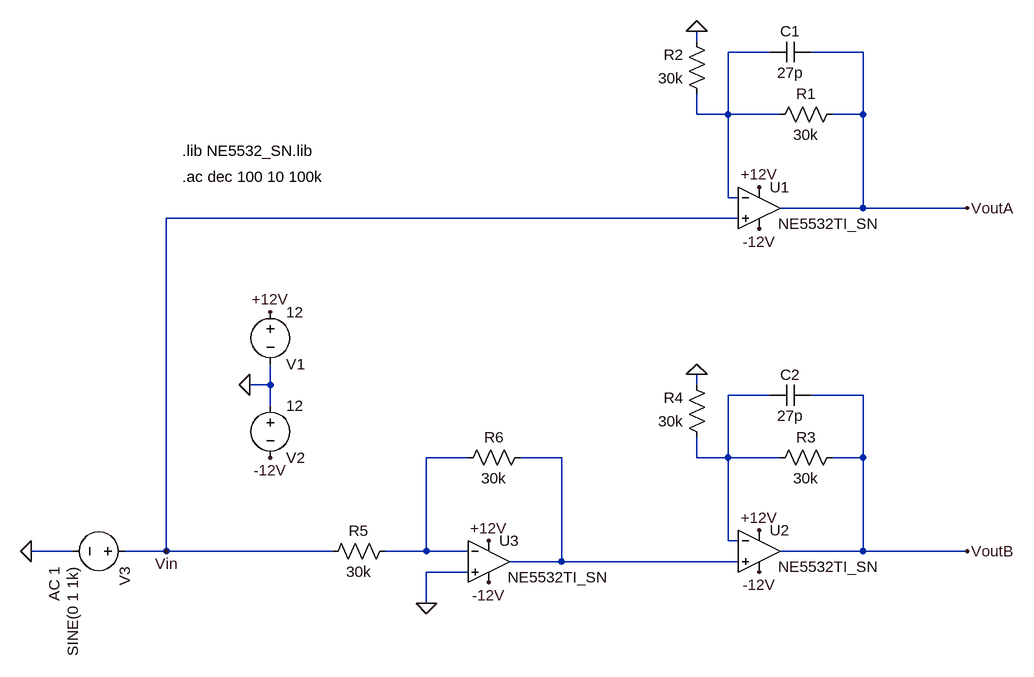
[diagram p0: schematic audio_amplifier.asc]
audio_amplifier.asc, the LTspice schematic file:
Version 4
SHEET 1 1172 960
WIRE 560 -80 560 -96
WIRE 672 -64 608 -64
WIRE 816 -64 736 -64
WIRE 560 32 560 0
WIRE 608 32 608 -64
WIRE 608 32 560 32
WIRE 688 32 608 32
WIRE 816 32 816 -64
WIRE 816 32 768 32
WIRE 608 160 608 32
WIRE 624 160 608 160
WIRE 816 176 816 32
WIRE 816 176 688 176
WIRE 976 176 816 176
WIRE 624 192 -256 192
WIRE -96 448 -96 416
WIRE -96 448 -128 448
WIRE 560 448 560 432
WIRE 672 464 608 464
WIRE 816 464 736 464
WIRE -96 480 -96 448
WIRE 208 560 144 560
WIRE 352 560 288 560
WIRE 560 560 560 528
WIRE 608 560 608 464
WIRE 608 560 560 560
WIRE 688 560 608 560
WIRE 816 560 816 464
WIRE 816 560 768 560
WIRE 608 688 608 560
WIRE 624 688 608 688
WIRE -400 704 -464 704
WIRE -256 704 -256 192
WIRE -256 704 -320 704
WIRE 0 704 -256 704
WIRE 144 704 144 560
WIRE 144 704 80 704
WIRE 208 704 144 704
WIRE 816 704 816 560
WIRE 816 704 688 704
WIRE 976 704 816 704
WIRE 352 720 352 560
WIRE 352 720 272 720
WIRE 624 720 352 720
WIRE 208 736 144 736
WIRE 144 784 144 736
FLAG -464 704 0
FLAG -96 560 -12V
FLAG -96 336 +12V
FLAG 656 144 +12V
FLAG 656 208 -12V
FLAG 976 176 VoutA
FLAG 560 -96 0
FLAG -256 704 Vin
FLAG -128 448 0
FLAG 656 672 +12V
FLAG 656 736 -12V
FLAG 976 704 VoutB
FLAG 560 432 0
FLAG 144 784 0
FLAG 240 752 -12V
FLAG 240 688 +12V
SYMBOL voltage -96 320 R0
WINDOW 0 24 96 Left 2
WINDOW 3 24 16 Left 2
WINDOW 123 0 0 Left 0
WINDOW 39 0 0 Left 0
SYMATTR InstName V1
SYMATTR Value 12
SYMBOL voltage -96 464 R0
WINDOW 0 24 96 Left 2
WINDOW 3 24 16 Left 2
WINDOW 123 0 0 Left 0
WINDOW 39 0 0 Left 0
SYMATTR InstName V2
SYMATTR Value 12
SYMBOL voltage -304 704 R90
WINDOW 123 24 124 Left 2
WINDOW 39 0 0 Left 0
SYMATTR Value2 AC 1
SYMATTR InstName V3
SYMATTR Value SINE(0 1 1k)
SYMBOL OpAmps\\opamp2 656 112 R0
WINDOW 3 29 88 Left 2
SYMATTR Value NE5532TI_SN
SYMATTR InstName U1
SYMATTR SpiceModel NE5532TI_SN
SYMBOL res 784 16 R90
WINDOW 0 0 56 VBottom 2
WINDOW 3 32 56 VTop 2
SYMATTR InstName R1
SYMATTR Value 30k
SYMBOL cap 736 -80 R90
WINDOW 0 0 32 VBottom 2
WINDOW 3 32 32 VTop 2
SYMATTR InstName C1
SYMATTR Value 27p
SYMBOL res 576 16 R180
WINDOW 0 36 76 Left 2
WINDOW 3 36 40 Left 2
SYMATTR InstName R2
SYMATTR Value 30k
SYMBOL OpAmps\\opamp2 656 640 R0
WINDOW 3 29 88 Left 2
SYMATTR Value NE5532TI_SN
SYMATTR InstName U2
SYMATTR SpiceModel NE5532TI_SN
SYMBOL res 784 544 R90
WINDOW 0 0 56 VBottom 2
WINDOW 3 32 56 VTop 2
SYMATTR InstName R3
SYMATTR Value 30k
SYMBOL cap 736 448 R90
WINDOW 0 0 32 VBottom 2
WINDOW 3 32 32 VTop 2
SYMATTR InstName C2
SYMATTR Value 27p
SYMBOL res 576 544 R180
WINDOW 0 36 76 Left 2
WINDOW 3 36 40 Left 2
SYMATTR InstName R4
SYMATTR Value 30k
SYMBOL OpAmps\\opamp2 240 656 R0
WINDOW 3 29 88 Left 2
SYMATTR Value NE5532TI_SN
SYMATTR InstName U3
SYMATTR SpiceModel NE5532TI_SN
SYMBOL res 96 688 R90
WINDOW 0 0 56 VBottom 2
WINDOW 3 32 56 VTop 2
SYMATTR InstName R5
SYMATTR Value 30k
SYMBOL res 304 544 R90
WINDOW 0 0 56 VBottom 2
WINDOW 3 32 56 VTop 2
SYMATTR InstName R6
SYMATTR Value 30k
TEXT -232 88 Left 2 !.lib NE5532_SN.lib
TEXT -232 128 Left 2 !.ac dec 100 10 100k

The netlist it stands for:
* audio_amplifier.asc
V1 +12V 0 12
V2 0 -12V 12
V3 Vin 0 SINE(0 1 1k) AC 1
XU1 Vin N001 +12V -12V VoutA NE5532TI_SN NE5532TI_SN  ; pins In+ In- V+ V- OUT
R1 VoutA N001 30k
C1 VoutA N001 27p
R2 N001 0 30k
XU2 N004 N002 +12V -12V VoutB NE5532TI_SN NE5532TI_SN  ; pins In+ In- V+ V- OUT
R3 VoutB N002 30k
C2 VoutB N002 27p
R4 N002 0 30k
XU3 0 N003 +12V -12V N004 NE5532TI_SN NE5532TI_SN  ; pins In+ In- V+ V- OUT
R5 N003 Vin 30k
R6 N004 N003 30k
.lib NE5532_SN.lib
.ac dec 100 10 100k
.backanno
.end